# Altium project Pedal_Back.PrjPcb
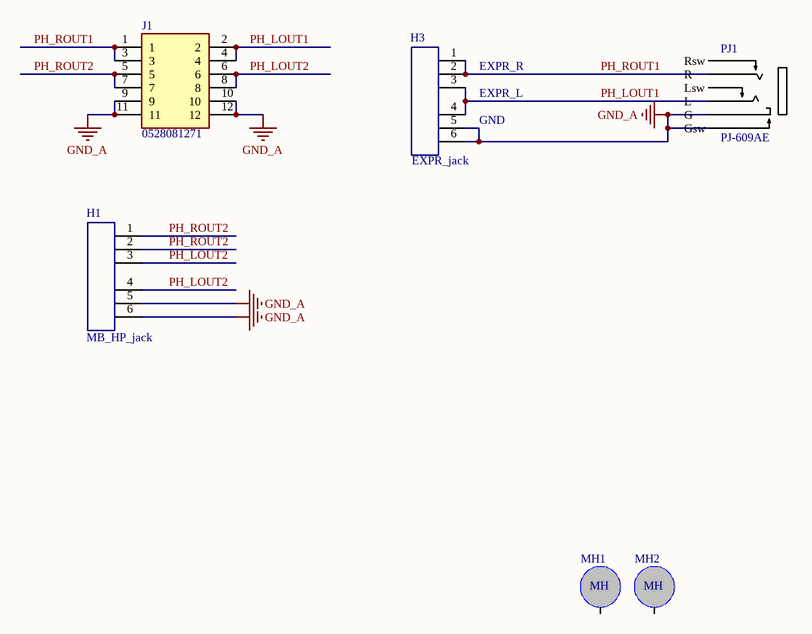
[diagram p0: Pedal_Back.SchDoc]
1 sheet, 6 parts. Net scope: global (net labels, ports and power ports of the same name join across sheets).
Board file: Pedal_Back.PcbDoc

## Sheet Pedal_Back.SchDoc
size A4; SheetNumber: 1; SheetTotal: 1

### Parts
H1  MB_HP_jack  [header-6_male]
H3  EXPR_jack  [header-6_male]
J1  0528081271  [AFA11-S12GLA-00]
MH1  MountingHole  [Hole_2.5mm]  (value not drawn)
MH2  MountingHole  [Hole_2.5mm]  (value not drawn)
PJ1  PJ-609AE  [PJ609AE]

### Nets
GND_A: H1.5 H1.6 H3.5 H3.6 J1.9 J1.10 J1.11 J1.12 PJ1.2(G) PJ1.3(Gsw)
PH_LOUT1: H3.3 H3.4 J1.2 J1.4 PJ1.6(L)
PH_LOUT2: H1.3 H1.4 J1.6 J1.8
PH_ROUT1: H3.1 H3.2 J1.1 J1.3 PJ1.4(R)
PH_ROUT2: H1.1 H1.2 J1.5 J1.7

Not connected (* = marked no-connect by the designer): MH1 0; MH2 0; PJ1 5(Rsw) 7(Lsw)

### Notes on the sheet
- (near H3) EXPR_R
- (near H3) EXPR_L
- (near H3) GND
- (in symbol MountingHole) MH

### Library data of the parts
H1 H3 = arduino_header_6: System: Connector
J1 = 0528081271: Connector; Manufacturer_Name: Molex; Datasheet Link: https://www.molex.com/pdm_docs/sd/528082071_sd.pdf; Height: 5.3mm; Manufacturer_Part_Number: 0528081271; System: Connector
PJ1 = PJ-609AE: 6.3mm jack HOOYA